# EAGLE schematic tykle_schematic (EAGLE 9.6.2)
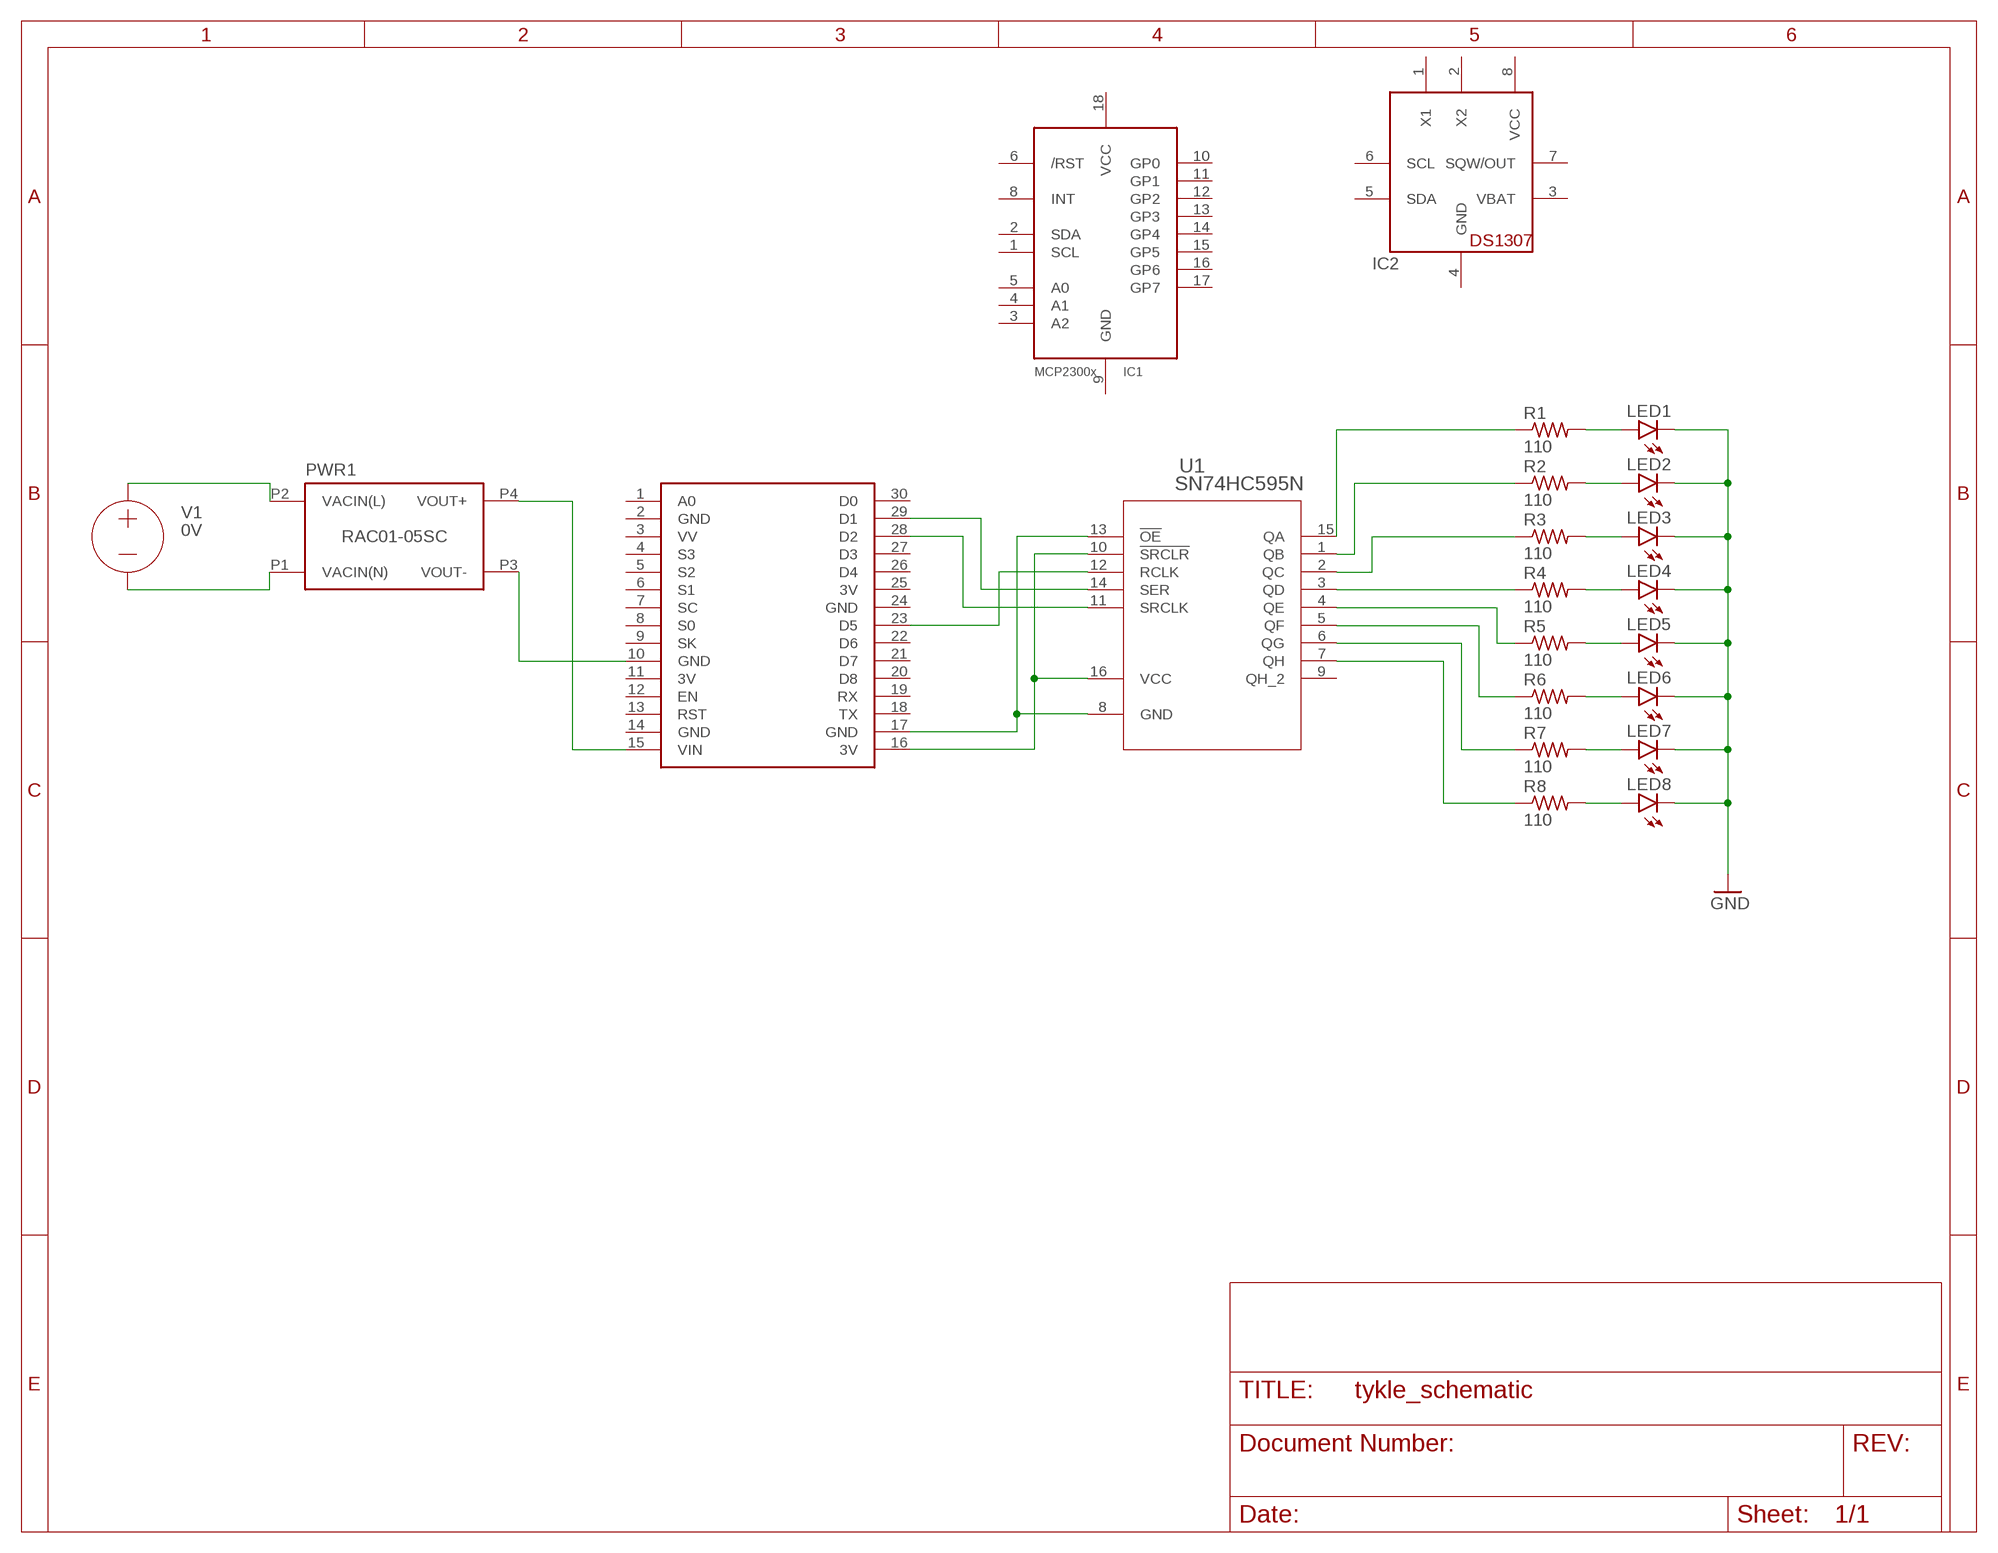
[diagram p0: schematic, sheet 1]

## Parts
IC1  MCP23008/P  [DIL18]
IC2  DS1307  [DIL08]
LED1  LED5MM  [LED5MM]
LED2  LED5MM  [LED5MM]
LED3  LED5MM  [LED5MM]
LED4  LED5MM  [LED5MM]
LED5  LED5MM  [LED5MM]
LED6  LED5MM  [LED5MM]
LED7  LED5MM  [LED5MM]
LED8  LED5MM  [LED5MM]
PWR1  RAC01-05SC  [LOW_PROFILE_POWER_MODULE]
R1  110  R-US_R0805  [R0805]
R2  110  R-US_R0805  [R0805]
R3  110  R-US_R0805  [R0805]
R4  110  R-US_R0805  [R0805]
R5  110  R-US_R0805  [R0805]
R6  110  R-US_R0805  [R0805]
R7  110  R-US_R0805  [R0805]
R8  110  R-US_R0805  [R0805]
U1  SN74HC595N  [N16]
U$1  NODEMCU  [NODEMCU]
V1  0V  VOLTAGE  (no package)

## Nets
GND: LED1.K(C) LED2.K(C) LED3.K(C) LED4.K(C) LED5.K(C) LED6.K(C) LED7.K(C) LED8.K(C)
N$1: PWR1.P2(VACIN(L)) V1.+
N$2: PWR1.P1(VACIN(N)) V1.-
N$3: PWR1.P4(VOUT+) U$1.15(VIN)
N$4: PWR1.P3(VOUT-) U$1.10(GND)
N$5: U1.8(GND) U1.13(!OE) U$1.17(GND)
N$6: U1.10(!SRCLR) U1.16(VCC) U$1.16(3V)
N$7: U1.12(RCLK) U$1.23(D5)
N$8: U1.14(SER) U$1.29(D1)
N$9: U1.11(SRCLK) U$1.28(D2)
N$10: R1.1 U1.15(QA)
N$11: R2.1 U1.1(QB)
N$12: R3.1 U1.2(QC)
N$13: R4.1 U1.3(QD)
N$14: R5.1 U1.4(QE)
N$15: R6.1 U1.5(QF)
N$16: R7.1 U1.6(QG)
N$17: R8.1 U1.7(QH)
N$18: LED7.A R7.2
N$19: LED1.A R1.2
N$20: LED2.A R2.2
N$21: LED3.A R3.2
N$22: LED6.A R6.2
N$23: LED5.A R5.2
N$24: LED4.A R4.2
N$26: LED8.A R8.2
Unconnected: IC1.1(SCL) IC1.2(SDA) IC1.3(A2) IC1.4(A1) IC1.5(A0) IC1.6(/RST) IC1.8(INT) IC1.10(GP0) IC1.11(GP1) IC1.12(GP2) IC1.13(GP3) IC1.14(GP4) IC1.15(GP5) IC1.16(GP6) IC1.17(GP7) IC2.1(X1) IC2.2(X2) IC2.5(SDA) IC2.6(SCL) IC2.7(SQW/OUT) U1.9(QH_2) U$1.1(A0) U$1.3(VV) U$1.4(S3) U$1.5(S2) U$1.6(S1) U$1.7(SC) U$1.8(S0) U$1.9(SK) U$1.12(EN) U$1.13(RST) U$1.18(TX) U$1.19(RX) U$1.20(D8) U$1.21(D7) U$1.22(D6) U$1.26(D4) U$1.27(D3) U$1.30(D0)

## Power pins joined to a net without a drawn wire
3V: U$1.11(3V) U$1.25(3V)
GND: IC1.9(GND) IC2.4(GND) U$1.2(GND) U$1.14(GND) U$1.24(GND)
VBAT: IC2.3(VBAT)
VCC: IC1.18(VCC) IC2.8(VCC)

## Library data of the parts
IC1 = adafruit:MCP23008: MCP23008 Inexpensive i2c i/o expander - 8 general purpose i/o pins with optional pullups
IC2 = adafruit:DS1307: DS1307 Real time clock (RTC) with battery backup ability. Talk to it via i2c
LED1-LED8 = led:LED: LED OSRAM: - CHIPLED LG R971, LG N971, LY N971, LG Q971, LY Q971, LO R971, LY R971 LH N974, LH R974 LS Q976, LO Q976, LY Q976 LO Q996 - Hyper CHIPLED LW Q18S LB Q993, LB Q99A, LB R99A - SideLED LS A670, LO A670, LY A670, LG A670, LP A670 LB A673, LV A673, LT A673, LW A673 LH A674 LY A675 LS A676, LA A676, LO A676, LY A676, LW A676 LS A679, LY A679, LG A679 - Hyper Micro SIDELED® LS Y876, LA Y876, LO Y876, LY Y876 LT Y87S - SmartLED LW L88C, LW L88S LB L89C, LB L89S, LG L890 LS L89K, LO L89K, LY L89K LS L896, LA L896, LO L896, LY L896 - TOPLED LS T670, LO T670, LY T670, LG T670, LP T670 LSG T670, LSP T670, LSY T670, LOP T670, LYG T670 LG T671, LOG T671, LSG T671 LB T673, LV T673, LT T673, LW T673 LH T674 LS T676, LA T676, LO T676, LY T676, LB T676, LH T676, LSB T676, LW T676 LB T67C, LV T67C, LT T67C, LS T67K, LO T67K, LY T67K, LW E67C LS E67B, LA E67B, LO E67B, LY E67B, LB E67C, LV E67C, LT E67C LW T67C LS T679, LY T679, LG T679 LS T770, LO T770, LY T770, LG T770, LP T770 LB T773, LV T773, LT T773, LW T773 LH T774 LS E675, LA E675, LY E675, LS T675 LS T776, LA T776, LO T776, LY T776, LB T776 LHGB T686 LT T68C, LB T68C - Hyper Mini TOPLED® LB M676 - Mini TOPLED Santana® LG M470 LS M47K, LO M47K, LY M47K Source: http://www.osram.convergy.de LUXEON: - LUMILED® LXK2-PW12-R00, LXK2-PW12-S00, LXK2-PW14-U00, LXK2-PW14-V00 LXK2-PM12-R00, LXK2-PM12-S00, LXK2-PM14-U00 LXK2-PE12-Q00, LXK2-PE12-R00, LXK2-PE12-S00, LXK2-PE14-T00, LXK2-PE14-U00 LXK2-PB12-K00, LXK2-PB12-L00, LXK2-PB12-M00, LXK2-PB14-N00, LXK2-PB14-P00, LXK2-PB14-Q00 LXK2-PR12-L00, LXK2-PR12-M00, LXK2-PR14-Q00, LXK2-PR14-R00 LXK2-PD12-Q00, LXK2-PD12-R00, LXK2-PD12-S00 LXK2-PH12-R00, LXK2-PH12-S00 LXK2-PL12-P00, LXK2-PL12-Q00, LXK2-PL12-R00 Source: www.luxeon.com KINGBRIGHT: KA-3528ASYC Source: www.kingbright.com
PWR1 = recom-powerline-acdc-converters:RAC*SC: RECOM POWERLINE AC/DC-Converter (RAC01-SC and RAC02-SC series) The RAC01-SC and RAC02-SC series are ultra-compact universal input AC/DC power modules for PCB mounting. They feature high efficiency, low standby power, high operating temperature, soft start and short-circuit protection as well as a built-in EMC Class B filter. Output voltages range from 3.3VDC to 24VDC. Datasheet <http://www.recom-power.com/pdf/Powerline-AC-DC/RAC01_02-SC.pdf>; INPUT_RANGE: 80 - 277 (VAC); MAX_CAPACITIVE_LOAD: 1000uF; OUTPUT_CURRENT: 200mA; OUTPUT_VOLTAGE: 5v
R1-R8 = rcl:R-US_: RESISTOR, American symbol; SPICEPREFIX: R
U1 = TI-SN74HC595:SN74HC595N; DATASHEET_URL: http://www.ti.com/lit/gpn/SN74HC595; DESCRIPTION: 8-Bit Shift Registers With 3-State Output Registers; FAMILY_NAME: SHIFT REGISTER; GENERIC_PART_NUMBER: SN74HC595; INDUSTRY_STD_PKG_TYPE: PDIP; MANUFACTURER: Texas Instruments; PACKAGE_DESIGNATOR: N; PIN_COUNT: 16
U$1 = nodemcu:NODEMCU
V1 = ngspice-simulation:VOLTAGE: Independent Voltage Source, either DC, AC, PULSE, SINE, PWL, EXP, or SFFM